# EAGLE design NodeEssential.v1.cg2 (EAGLE 4.11)
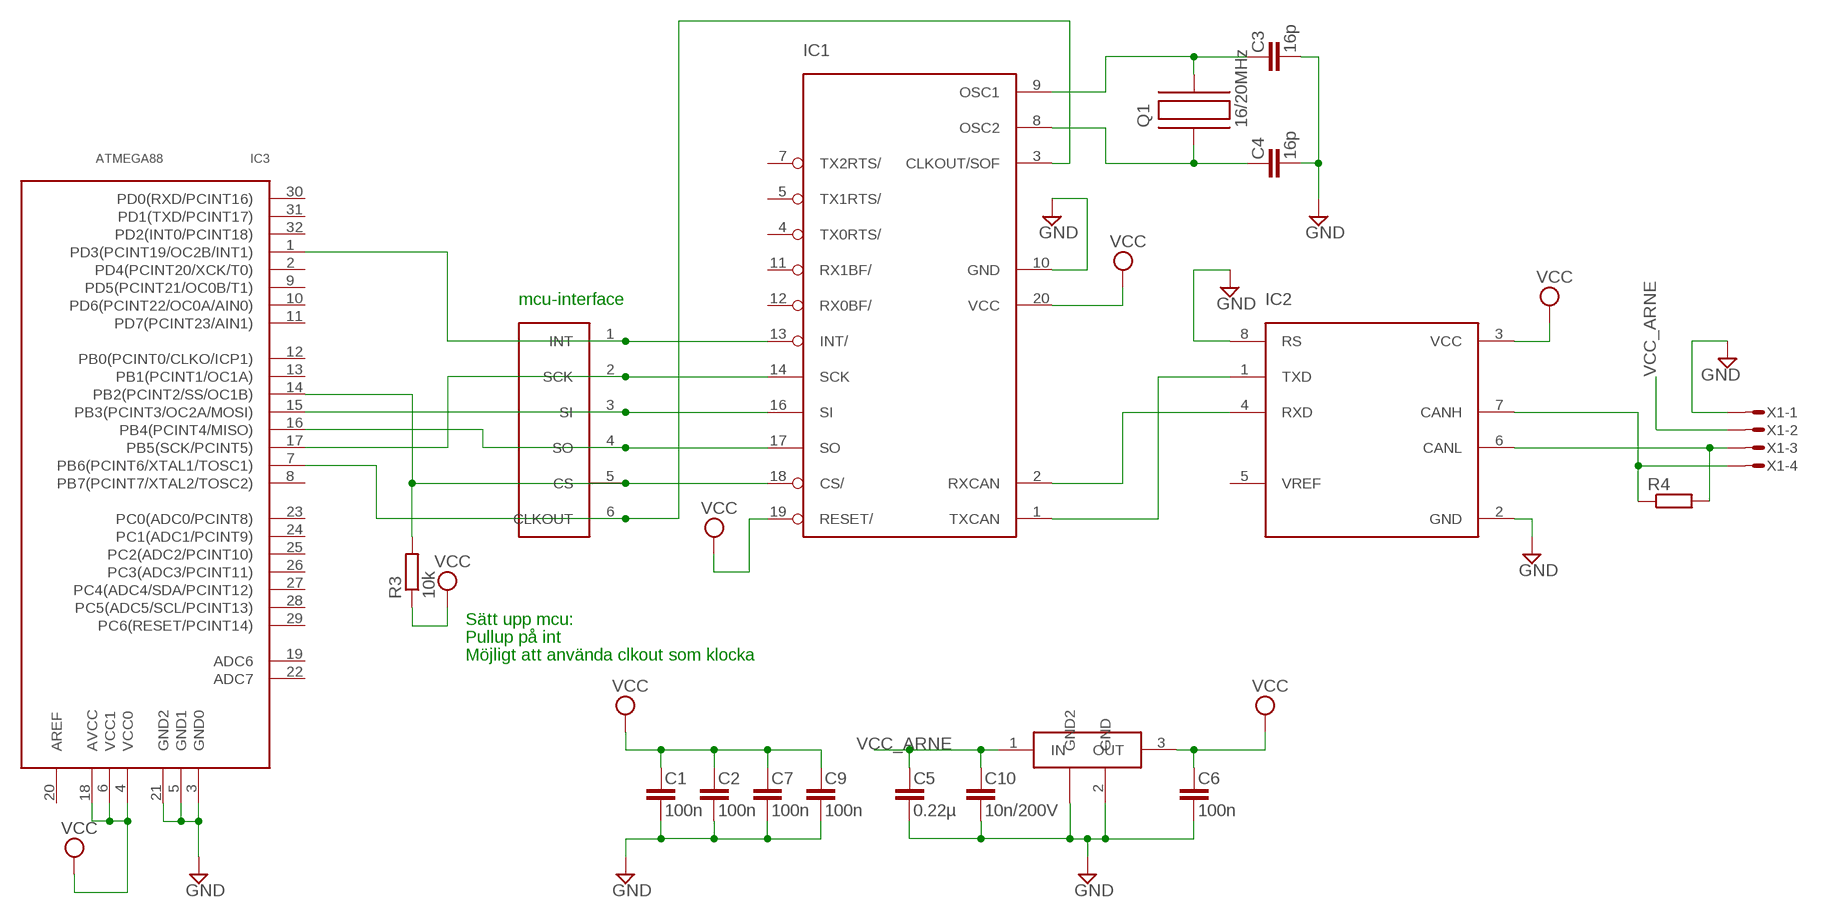
[diagram p0: schematic, sheet 1]

## Parts
C1  100n  C-EU  [C0603]
C2  100n  C-EU  [C0603]
C3  16p  C-EU  [C0603]
C4  16p  C-EU  [C0603]
C5  0.22µ  C-EU  [C0603]
C6  100n  C-EU  [C0603]
C7  100n  C-EU  [C0603]
C9  100n  C-EU  [C0603]
C10  10n/200V  C-EU  [C0603]
IC1  MCP2515  [TSSOP]
IC2  MCP2551  [TSSOP]
IC3  ATMEGA88  [TQFP32]
IC4  LM340MP-5.0  [SOT223]
Q1  16/20MHz  C-MAC-LFA147E  [SMD]
R3  10k  R-EUR0603  [R0603]
R4  R-EUR0603  [R0603]
U$1  CAN-INTERFACE  [VIA-LIST]
X1  MICROMATCH-4  [MICROMATCH-4-SMD]

## Nets
CANH: IC2.7(CANH) R4.1 X1.4
CLK: IC1.3(CLKOUT/SOF) IC3.7(PB6(PCINT6/XTAL1/TOSC1)) U$1.6(CLKOUT)
CS: IC1.18(CS/) IC3.14(PB2(PCINT2/SS/OC1B)) R3.2 U$1.5(CS)
GND: C1.2 C2.2 C3.2 C4.2 C5.2 C6.2 C7.2 C9.2 C10.2 IC1.10(GND) IC2.2(GND) IC2.8(RS) IC3.3(GND0) IC3.5(GND1) IC3.21(GND2) IC4.2(GND) IC4.4(GND2) X1.1
INT: IC1.13(INT/) IC3.1(PD3(PCINT19/OC2B/INT1)) U$1.1(INT)
MISO: IC1.17(SO) IC3.16(PB4(PCINT4/MISO)) U$1.4(SO)
MOSI: IC1.16(SI) IC3.15(PB3(PCINT3/OC2A/MOSI)) U$1.3(SI)
N$1: IC1.2(RXCAN) IC2.4(RXD)
N$2: IC1.1(TXCAN) IC2.1(TXD)
N$3: IC2.6(CANL) R4.2 X1.3
N$12: C3.1 IC1.9(OSC1) Q1.P$2
N$13: C4.1 IC1.8(OSC2) Q1.P$1
SCK: IC1.14(SCK) IC3.17(PB5(SCK/PCINT5)) U$1.2(SCK)
VCC: C1.1 C2.1 C6.1 C7.1 C9.1 IC1.19(RESET/) IC1.20(VCC) IC2.3(VCC) IC3.4(VCC0) IC3.6(VCC1) IC3.18(AVCC) IC4.3(OUT) R3.1
VCC_ARNE: C5.1 C10.1 IC4.1(IN) X1.2
Unconnected: IC1.4(TX0RTS/) IC1.5(TX1RTS/) IC1.7(TX2RTS/) IC1.11(RX1BF/) IC1.12(RX0BF/) IC2.5(VREF) IC3.2(PD4(PCINT20/XCK/T0)) IC3.8(PB7(PCINT7/XTAL2/TOSC2)) IC3.9(PD5(PCINT21/OC0B/T1)) IC3.10(PD6(PCINT22/OC0A/AIN0)) IC3.11(PD7(PCINT23/AIN1)) IC3.12(PB0(PCINT0/CLKO/ICP1)) IC3.13(PB1(PCINT1/OC1A)) IC3.19(ADC6) IC3.20(AREF) IC3.22(ADC7) IC3.23(PC0(ADC0/PCINT8)) IC3.24(PC1(ADC1/PCINT9)) IC3.25(PC2(ADC2/PCINT10)) IC3.26(PC3(ADC3/PCINT11)) IC3.27(PC4(ADC4/SDA/PCINT12)) IC3.28(PC5(ADC5/SCL/PCINT13)) IC3.29(PC6(RESET/PCINT14)) IC3.30(PD0(RXD/PCINT16)) IC3.31(PD1(TXD/PCINT17)) IC3.32(PD2(INT0/PCINT18))

## Notes on the sheet
- mcu-interface
- Sätt upp mcu:
- Pullup på int
- Möjligt att använda clkout som klocka

## Library data of the parts
C1-C7 C9 C10 = rcl:C-EU
IC1 = mcp2515:MCP2515
IC2 = mcp2551:MCP2551
IC3 = atmega88:ATMEGA88
IC4 = lm340mp:LM340MP-5.0
Q1 = hc49-4h-smx:C-MAC-LFA147E
R3 R4 = rcl:R-EU
U$1 = can-interface:CAN-INTERFACE
X1 = micromatch-smd:MICROMATCH-4: MicroMaTch 4 7-215464-4 / 0-215464-4 Drawing Number C-215464 DDEController.pdf

## Board
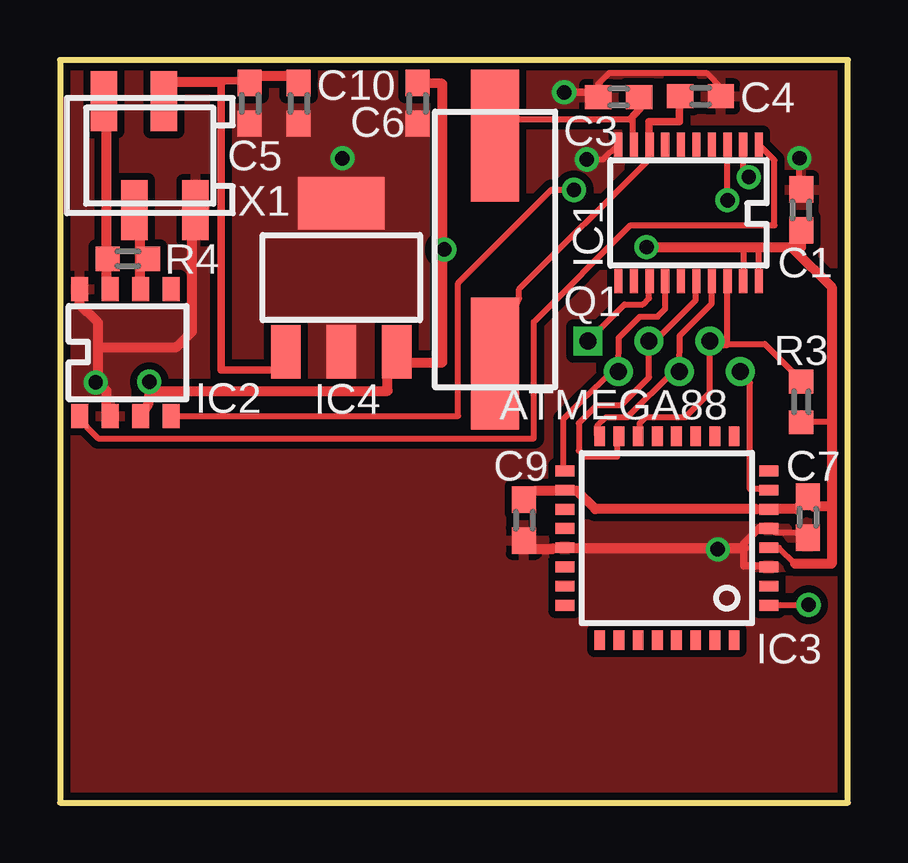
[diagram p1: board, top side]
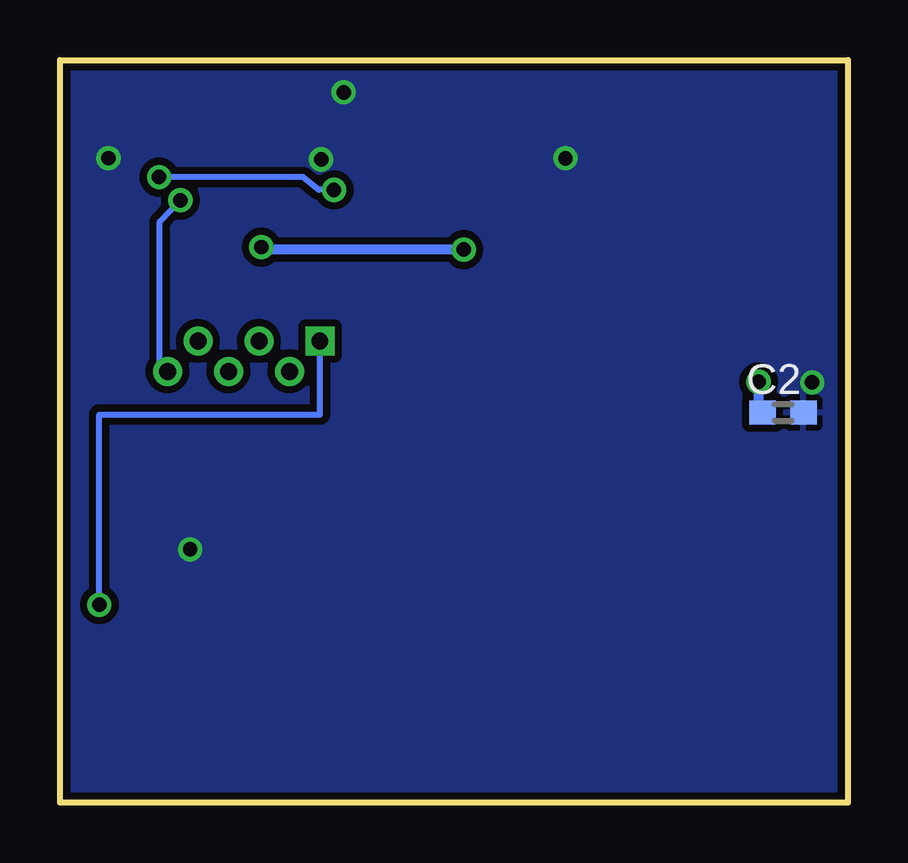
[diagram p2: board, bottom side, seen from below]

Size 32.85 x 30.97 mm. Coordinates in mm from the lower left corner, seen from the top.
Outline: 0,0 32.85,0 32.85,30.97 0,30.97 0,0
Copper layers (1*16): Top 0.035mm / dielectric 1.5mm / Bottom 0.035mm
Design rules "10mils, 0.6drill": minimum track width 10mil, minimum drill 0.6mm, track to track 10mil, track to pad 10mil, pad to pad 10mil, via to via 10mil, smd to smd 10mil, copper to edge 10mil, drill to drill 10mil, minimum pad ring 10mil, minimum via ring 8mil, stop-mask expansion 0mil, vias tented up to drill 0mil, thermal gap 10mil

### Footprints (pad centres in the part's own frame; a part is rotated, then mirrored left to right if it is on the bottom)
C0603 = smd 1.1 x 1: 1 -0.85,0; 2 0.85,0
TSSOP = smd 0.34 x 1: 1 -2.925,-2.85; 2 -2.275,-2.85; 3 -1.625,-2.85; 4 -0.975,-2.85; 5 -0.325,-2.85; 6 0.325,-2.85; 7 0.975,-2.85; 8 1.625,-2.85; 9 2.275,-2.85; 10 2.925,-2.85; 11 2.925,2.85; 12 2.275,2.85; 13 1.625,2.85; 14 0.975,2.85; 15 0.325,2.85; 16 -0.325,2.85; 17 -0.975,2.85; 18 -1.625,2.85; 19 -2.275,2.85; 20 -2.925,2.85
TSSOP' = smd 0.7 x 1: 1 -1.981,-2.645; 2 -0.711,-2.645; 3 0.559,-2.645; 4 1.829,-2.645; 5 1.829,2.645; 6 0.559,2.645; 7 -0.711,2.645; 8 -1.981,2.645
TQFP32 = smd 0.8 x 0.45: 1 -4.25,2.65; 2 -4.25,1.85; 3 -4.25,1.05; 4 -4.25,0.25; 5 -4.25,-0.55; 6 -4.25,-1.35; 7 -4.25,-2.15; 8 -4.25,-2.95; 17 4.25,-2.95; 18 4.25,-2.15; 19 4.25,-1.35; 20 4.25,-0.55; 21 4.25,0.25; 22 4.25,1.05; 23 4.25,1.85; 24 4.25,2.65 | smd 0.45 x 0.8: 9 -2.8,-4.4; 10 -2,-4.4; 11 -1.2,-4.4; 12 -0.4,-4.4; 13 0.4,-4.4; 14 1.2,-4.4; 15 2,-4.4; 16 2.8,-4.4; 25 2.8,4.1; 26 2,4.1; 27 1.2,4.1; 28 0.4,4.1; 29 -0.4,4.1; 30 -1.2,4.1; 31 -2,4.1; 32 -2.8,4.1
SOT223 = smd 1.219 x 2.235: 1 -2.311,-3.099; 2 0,-3.099; 3 2.311,-3.099 | smd 3.6 x 2.2: 4 0,3.099
SMD = smd 5.5 x 2: P$1 4.75,0; P$2 -4.75,0
R0603 = smd 0.991 x 1.016: 1 -0.85,0; 2 0.85,0
VIA-LIST = drill 0.7 square: 1 0,2.54 | drill 0.7 round: 2 -1.27,1.27; 3 0,0; 4 -1.27,-1.27; 5 0,-2.54; 6 -1.27,-3.81
MICROMATCH-4-SMD = smd 1.1 x 2.5: 1 1.905,-2.272; 2 0.585,2.272; 3 -0.635,-2.272; 4 -1.905,2.272

### Placement (x,y rotation side)
C1  30.9,24.71 90 top
C2  2.7,16.27 0 bottom
C3  23.29,29.42 180 top
C4  26.7,29.45 0 top
C5  7.92,29.16 270 top
C6  14.9,29.16 270 top
C7  31.17,11.9 270 top
C9  19.34,11.78 270 top
C10  9.95,29.16 270 top
IC1  26.21,24.59 180 top
IC2  MCP2551  [TSSOP']  2.8,18.77 0 top
IC3  25.3,10.88 180 top
IC4  11.73,21.89 0 top
Q1  18.14,23.07 270 top
R3  30.9,16.71 90 top
R4  2.84,22.68 0 top
U$1  24.55,19.25 90 top
X1  3.75,26.97 0 top

### Tracks (layer width: path | path; a pad name or v marks a point on that pad's centre or on a via)
CANH
  Top 0.254: 1.95,21.72 1.95,21.67 | 2.05,21.72 1.95,21.72 | R4.1 1.95,22.68 1.95,21.72
  Top 0.406: X1.4 1.95,29.14 1.95,21.92 2.05,21.72 2.07,21.67 2.07,21.43 IC2.7
CLK  (via drill 0.6)
  Top 0.254: v27.83,25.12 27.83,26.95 IC1.3 | IC3.7 29.18,13.08 28.77,13.08 28.77,17.5 U$1.6
  Bottom 0.254: v27.83,25.12 28.69,24.23 28.69,18.14 U$1.6
CS
  Top 0.254: IC1.18 27.83,19.09 27.22,19.09 | 27.15,19.17 U$1.5 | 27.15,19.17 27.22,19.09 | 27.22,19.09 27.47,19.13 | 27.47,19.13 29.38,19.13 30.65,17.86 R3.2 | 27.47,19.13 27.22,19.13 | 27.15,19.17 27.11,19.13 27.09,19.13 27.09,17.09 26.08,16.08 24.43,16.08 24.17,15.82 24.17,15.35 IC3.14
GND  (via drill 0.6)
  Top 0.254: v21.96,26.82 22.65,26.82 IC1.10 | v30.83,26.87 30.83,26.01 C1.2 | 1.59,17.53 v1.49,17.53 | 20.56,10.59 IC3.21 21.28,10.62 | C9.2 19.8,10.59 | 29.18,9.88 IC3.3 | 29.18,11.48 IC3.5 29.81,11.28 30.7,11.28 C7.2 | 27.27,10.62 v27.42,10.57 | C3.2 22.44,29.97 22.9,30.43 26.97,30.43 27.6,29.8 27.55,29.75 C4.2
  Top 0.305: IC2.2 1.95,16.56 | C3.2 22.15,29.62 v21.02,29.62 | 29.18,9.88 28.51,9.88 28.51,10.62 28.51,10.82 29.18,11.48
  Top 0.406: 1.95,16.56 1.95,17.17 1.59,17.53 1.59,19 | 1.59,19 1.59,20.02 0.83,20.78 IC2.8 | 19.8,10.59 20.56,10.59 | 21.28,10.62 27.27,10.62 28.51,10.62 | X1.1 5.65,23.93 5.5,23.7 5.5,19.63 4.87,19 1.59,19
  Bottom 0.305: v21.02,29.62 20.97,29.57
  other vias: 11.78,26.87
  pour Bottom (isolate 0.305): -0.01,30.99 32.83,30.99 32.83,-0.03 24.38,-0.03 -0.01,-0.03
  pour Top (isolate 0.305, no thermals): 6.95,30.5 15.89,30.5 15.89,17.31 6.95,17.31
  pour Top (isolate 0.305): -0.21,31.19 33.06,31.19 33.06,-0.18 -0.21,-0.18
INT  (via drill 0.6)
  Top 0.254: 24.58,21.62 | 24.58,21.62 IC1.13 | 29.81,8.26 v31.21,8.26 | U$1.1 23.54,20.78 24.3,20.78 24.55,21.03 24.55,21.59 24.58,21.62
  Top 0.305: IC3.1 29.81,8.26
  Bottom 0.254: v31.21,8.26 31.21,16.18 22.01,16.18 22.01,19 22.02,19.01 U$1.1
MISO
  Top 0.254: IC1.17 27.18,21.68 27.17,21.67 27.17,20.8 25.84,19.47 U$1.4 25.57,17.98 23.66,16.08 22.77,16.08 22.39,15.7 22.39,15.3 IC3.16
MOSI
  Top 0.254: 24.61,19.15 U$1.3 | 24.61,19.15 24.64,19.09 26.51,20.96 26.51,21.72 IC1.16 | IC3.15 23.23,14.88 23.23,14.43 21.89,14.43 21.63,14.68 21.63,15.82 22.39,16.59 23.41,16.59 24.55,17.73 24.55,18.87 24.58,19.15 24.61,19.15
N$1  (via drill 0.6)
  Top 0.254: v21.43,25.55 20.49,25.55 16.6,21.67 16.6,16.13 4.94,16.13 IC2.4 | v28.72,26.09 28.49,26.31 IC1.2
  Bottom 0.254: v21.43,25.55 22.06,25.55 22.72,26.09 v28.72,26.09
N$2
  Top 0.254: IC2.1 1.13,15.65 1.59,15.19 19.75,15.19 19.75,20.04 23.79,24.08 29.79,24.08 29.79,26.79 IC1.1
N$3
  Top 0.254: R4.2 3.34,22.68 3.34,21.79
  Top 0.406: IC2.6 3.34,21.41 3.34,21.79 3.34,23.71 X1.3
N$12
  Top 0.254: IC1.9 23.87,27.91 23.87,28.5 23.79,28.5 19.14,28.5 Q1.P$2
  Top 0.305: C3.1 24.17,28.94 23.79,28.5
N$13
  Top 0.254: IC1.8 24.53,26.95 24.53,26.8 19.14,21.41 19.14,21.03 Q1.P$1
  Top 0.305: IC1.8 24.55,27.44 24.55,27.76 24.55,28.4 25.82,28.4 25.82,29.03 25.82,29.45 C4.1
SCK
  Top 0.254: IC1.14 25.23,21.71 25.19,21.67 25.24,21.62 25.24,20.6 24.91,20.27 24.17,20.27 23.29,19.39 U$1.2 23.04,18 23.05,18.01 21.73,16.74 21,16 21,13.77 IC3.17
VCC  (via drill 0.6)
  Top 0.254: 3.73,17.09 3.78,17.17 | 29.81,12.24 IC3.6 29.05,12.24 | 21.28,13.01 IC3.18 | IC3.4 29.97,10.63 30.65,9.96 | IC1.20 29.12,23.17 29.68,23.17 | 32.17,15.86 R3.1 | IC1.19 28.48,21.68 28.49,21.67 28.49,23.17 28.49,23.19 | 30.57,23.09 30.9,23.09 30.9,23.19
  Top 0.305: 13.66,17.93 IC4.3
  Top 0.406: C6.1 15.95,29.98 15.95,23.06 | 15.95,23.06 15.95,18.35 14.08,18.35 14.08,19.05 IC4.3 | 3.78,17.17 13.66,17.17 13.66,17.93 | IC2.3 3.67,16.61 3.73,17.09 v3.73,17.55 | 15.95,23.06 v16.02,23.06 | v24.45,23.17 28.49,23.17 29.68,23.17 | 29.68,23.17 29.68,23.16 | IC3.18 20.56,13.01 19.8,13.01 C9.1 | 30.65,9.96 32.17,9.96 32.17,12.34 | 32.17,12.34 31.41,12.34 C7.1 30.7,12.24 29.81,12.24 | 21.28,13.01 21.56,13.01 22.32,12.24 29.05,12.24 | 32.17,12.34 32.17,15.86 32.17,21.49 30.57,23.09 | 29.68,23.17 30.9,23.17 30.9,23.19 C1.1
  Bottom 0.254: C2.1 3.73,16.77
  Bottom 0.406: 3.73,16.77 v3.73,17.55 | v24.45,23.17 24.4,23.17 24.3,23.06 v16.02,23.06
VCC_ARNE
  Top 0.305: C5.1 7.84,30.1 6.72,30.1 6.72,30.05 6.72,18.03 9.31,18.03 9.31,18.79 IC4.1
  Top 0.406: C10.1 9.95,30.3 7.92,30.3 C5.1 | X1.2 4.37,30.05 6.72,30.05